# Altium schematic sheet BMS_CPU.SchDoc
size B; Organization: Altium Limited; Address1: L3, 12a Rodborough Rd; Address2: Frenchs Forest; Address3: NSW; Address4: Australia 2086
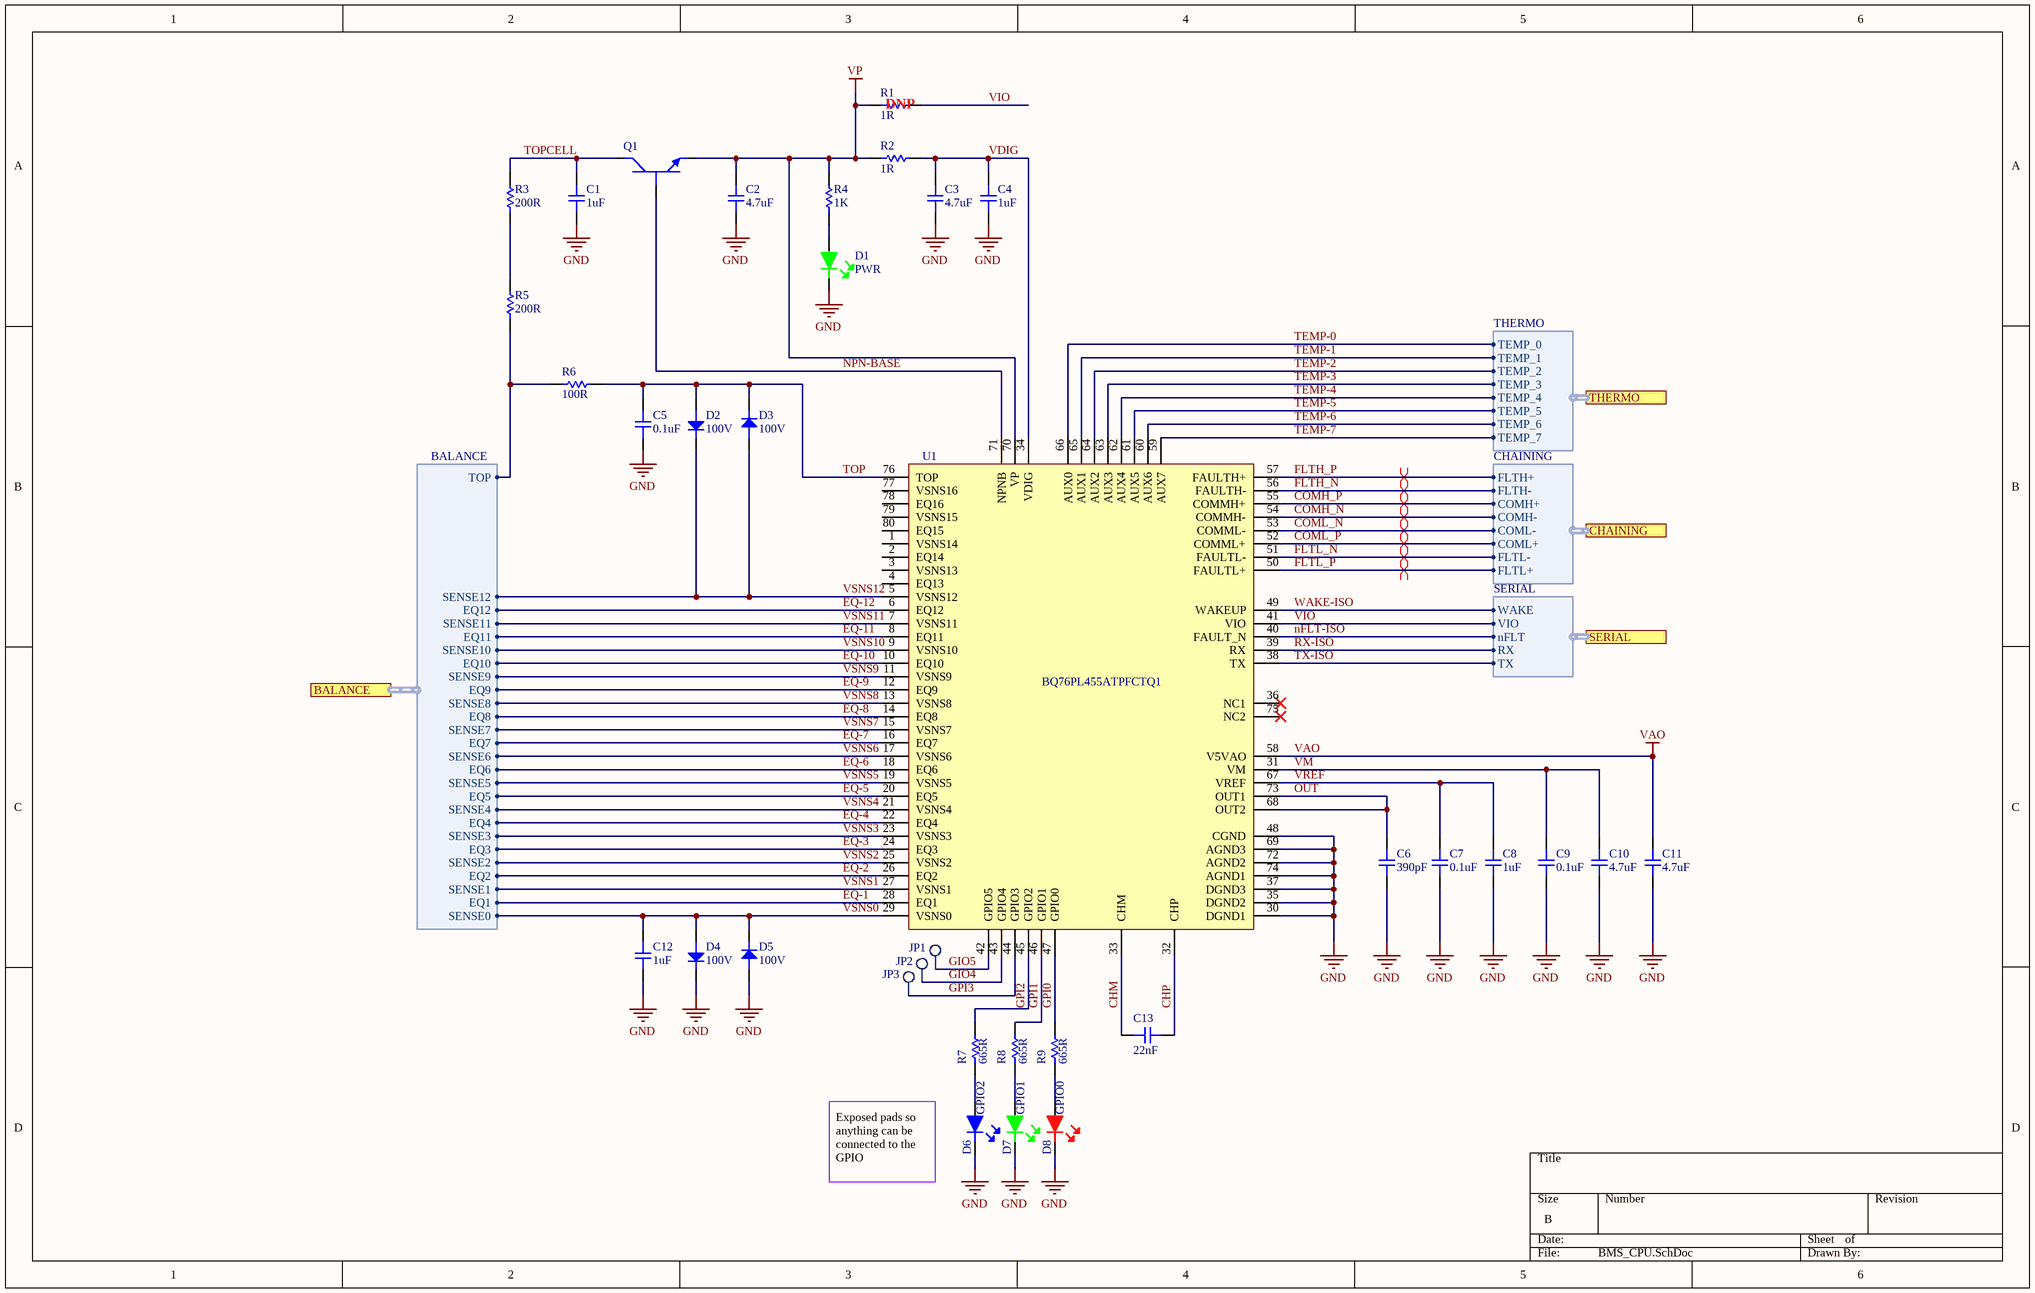
[diagram p0: BMS_CPU.SchDoc]

## Parts
C1  1uF  [CAP-0805]
C2  4.7uF  [CAP-0805]
C3  4.7uF  [CAP-0805]
C4  1uF  [CAP-0805]
C5  0.1uF  [CAP-0805]
C6  390pF  [CAP-0805]
C7  0.1uF  [CAP-0805]
C8  1uF  [CAP-0805]
C9  0.1uF  [CAP-0805]
C10  4.7uF  [CAP-0805]
C11  4.7uF  [CAP-0805]
C12  1uF  [CAP-0805]
C13  22nF  [CAP-0603]
D1  PWR  [LED-0603]
D2  100V  [DIODE-SOD123]
D3  100V  [DIODE-SOD123]
D4  100V  [DIODE-SOD123]
D5  100V  [DIODE-SOD123]
D6  GPIO2  [LED-0603]
D7  GPIO1  [LED-0603]
D8  GPIO0  [LED-0603]
JP1  Testpoint2  [TP2]  (value not drawn)
JP2  Testpoint2  [TP2]  (value not drawn)
JP3  Testpoint2  [TP2]  (value not drawn)
Q1  ZXTN4004KTCDICT-ND  [DPAK-TO252]  (value not drawn)
R1  1R  [RES-0603]
R2  1R  [RES-0603]
R3  200R  [RES-2512]
R4  1K  [RES-0603]
R5  200R  [RES-2512]
R6  100R  [RES-1206]
R7  665R  [RES-0603]
R8  665R  [RES-0603]
R9  665R  [RES-0603]
U1  BQ76PL455ATPFCTQ1  [BQ76PL455A]

## Ports
BALANCE (harness BALANCE), CHAINING (harness CHAINING), SERIAL (harness SERIAL), THERMO (harness THERMO)

## Harnesses
CHAINING: FLTH+, FLTH-, COMH+, COMH-, COML-, COML+, FLTL-, FLTL+
THERMO: TEMP_0, TEMP_1, TEMP_2, TEMP_3, TEMP_4, TEMP_5, TEMP_6, TEMP_7
SERIAL: WAKE, VIO, nFLT, RX, TX
BALANCE: EQ6, SENSE6, EQ7, SENSE7, EQ8, SENSE8, EQ9, SENSE9, SENSE5, EQ5, SENSE4, EQ4, SENSE3, EQ3, SENSE2, EQ2, SENSE1, EQ1, SENSE0, SENSE10, EQ10, TOP, EQ11, SENSE11, SENSE12, EQ12

## Nets
GND: C1.1 C2.1 C3.1 C4.1 C5.2 C6.1 C7.2 C8.1 C9.1 C10.1 C11.1 C12.1 D1.2 D4.1 D5.2 D6.2 D7.2 D8.2 U1.30(DGND1) U1.35(DGND2) U1.37(DGND3) U1.48(CGND) U1.69(AGND3) U1.72(AGND2) U1.74(AGND1)
VAO: C11.2 U1.58(V5VAO)
VP: C2.2 Q1.3 R1.1 R2.1 R4.2 U1.70(VP)
CHM: C13.1 U1.33(CHM)
CHP: C13.2 U1.32(CHP)
COMH_N: U1.54(COMMH-) ; port CHAINING.COMH-
COMH_P: U1.55(COMMH+) ; port CHAINING.COMH+
COML_N: U1.53(COMML-) ; port CHAINING.COML-
COML_P: U1.52(COMML+) ; port CHAINING.COML+
EQ-1: U1.28(EQ1) ; port BALANCE.EQ1
EQ-2: U1.26(EQ2) ; port BALANCE.EQ2
EQ-3: U1.24(EQ3) ; port BALANCE.EQ3
EQ-4: U1.22(EQ4) ; port BALANCE.EQ4
EQ-5: U1.20(EQ5) ; port BALANCE.EQ5
EQ-6: U1.18(EQ6) ; port BALANCE.EQ6
EQ-7: U1.16(EQ7) ; port BALANCE.EQ7
EQ-8: U1.14(EQ8) ; port BALANCE.EQ8
EQ-9: U1.12(EQ9) ; port BALANCE.EQ9
EQ-10: U1.10(EQ10) ; port BALANCE.EQ10
EQ-11: U1.8(EQ11) ; port BALANCE.EQ11
EQ-12: U1.6(EQ12) ; port BALANCE.EQ12
FLTH_N: U1.56(FAULTH-) ; port CHAINING.FLTH-
FLTH_P: U1.57(FAULTH+) ; port CHAINING.FLTH+
FLTL_N: U1.51(FAULTL-) ; port CHAINING.FLTL-
FLTL_P: U1.50(FAULTL+) ; port CHAINING.FLTL+
GIO4: JP2.1 U1.43(GPIO4)
GIO5: JP1.1 U1.42(GPIO5)
GPI0: R9.2 U1.47(GPIO0)
GPI1: R8.2 U1.46(GPIO1)
GPI2: R7.2 U1.45(GPIO2)
GPI3: JP3.1 U1.44(GPIO3)
nFLT-ISO: U1.40(FAULT_N) ; port SERIAL.nFLT
NPN-BASE: Q1.1 U1.71(NPNB)
OUT: C6.2 U1.68(OUT2) U1.73(OUT1)
RX-ISO: U1.39(RX) ; port SERIAL.RX
TEMP-0: U1.66(AUX0) ; port THERMO.TEMP_0
TEMP-1: U1.65(AUX1) ; port THERMO.TEMP_1
TEMP-2: U1.64(AUX2) ; port THERMO.TEMP_2
TEMP-3: U1.63(AUX3) ; port THERMO.TEMP_3
TEMP-4: U1.62(AUX4) ; port THERMO.TEMP_4
TEMP-5: U1.61(AUX5) ; port THERMO.TEMP_5
TEMP-6: U1.60(AUX6) ; port THERMO.TEMP_6
TEMP-7: U1.59(AUX7) ; port THERMO.TEMP_7
TOP: C5.1 D2.2 D3.1 R6.2 U1.76(TOP)
TOPCELL: C1.2 Q1.2 R3.2
TX-ISO: U1.38(TX) ; port SERIAL.TX
VDIG: C3.2 C4.2 R2.2 U1.34(VDIG)
VIO: R1.2 U1.41(VIO) ; port SERIAL.VIO
VM: C9.2 C10.2 U1.31(VM)
VREF: C7.1 C8.2 U1.67(VREF)
VSNS0: C12.2 D4.2 D5.1 U1.29(VSNS0) ; port BALANCE.SENSE0
VSNS1: U1.27(VSNS1) ; port BALANCE.SENSE1
VSNS2: U1.25(VSNS2) ; port BALANCE.SENSE2
VSNS3: U1.23(VSNS3) ; port BALANCE.SENSE3
VSNS4: U1.21(VSNS4) ; port BALANCE.SENSE4
VSNS5: U1.19(VSNS5) ; port BALANCE.SENSE5
VSNS6: U1.17(VSNS6) ; port BALANCE.SENSE6
VSNS7: U1.15(VSNS7) ; port BALANCE.SENSE7
VSNS8: U1.13(VSNS8) ; port BALANCE.SENSE8
VSNS9: U1.11(VSNS9) ; port BALANCE.SENSE9
VSNS10: U1.9(VSNS10) ; port BALANCE.SENSE10
VSNS11: U1.7(VSNS11) ; port BALANCE.SENSE11
VSNS12: D2.1 D3.2 U1.5(VSNS12) ; port BALANCE.SENSE12
WAKE-ISO: U1.49(WAKEUP) ; port SERIAL.WAKE
NetD1_1: D1.1 R4.1
NetD6_1: D6.1 R7.1
NetD7_1: D7.1 R8.1
NetD8_1: D8.1 R9.1
NetR3_1: R3.1 R5.2
NetR5_1: R5.1 R6.1 ; port BALANCE.TOP

Not connected (* = marked no-connect by the designer): U1 1(VSNS14) 2(EQ14) 3(VSNS13) 4(EQ13) 36(NC1)* 75(NC2)* 77(VSNS16) 78(EQ16) 79(VSNS15) 80(EQ15)

## Layout directives
differential pair: COMH_N, COMH_P, COML_N, COML_P, FLTH_N, FLTH_P, FLTL_N, FLTL_P

## Notes on the sheet
- (near R1) DNP
- Exposed pads so anything can be connected to the GPIO
- Title
- Size:
- Date:
- Tabloid
- Number:
- Time:
- Revision:
- Sheet
- of
- File:

## Library data of the parts
C1 C8 C12 = 0805-1uF-50V: CAP CER 1UF 50V X5R 0805; Manufacturer: KEMET; Manufacturer Part Number: C0805C105K5PACTU; Dielectric Material: Ceramic; Tolerance: 10%; Supplier 1: Digi-Key; Stock 1: 7193; Pricing 1: 1=0.33, 10=0.23, 100=0.1378, 500=0.10334, 1000=0.08726 (USD); Mount: Surface Mount; Case/Package: 0805; Weight: 0.000194oz; Case Code (Metric): 2012; Case Code (Imperial): 0805; Min Operating Temperature: -55°C; Max Operating Temperature: 85°C; Voltage Rating: 50V; Dielectric: X5R; Packaging: Tape and Reel; Termination: SMD/SMT; Voltage Rating (DC): 50V; Package Quantity: 2500; Capacitance: 1uF; Length: 0.079inch; Width: 0.049inch; Thickness: 0.055inch; REACH SVHC: No SVHC; Lead Free: Lead Free; ComponentLink1URL: https://api.kemet.com/component-edge/download/datasheet/C0805C105K5PAC7800.pdf?src-supplier=Digi-Key; ComponentLink1Description: https://api.kemet.com/component-edge/download/datasheet/C0805C105K5PAC7800.pdf?src-supplier=Digi-Key; ComponentLink2URL: http://www.farnell.com/datasheets/2746140.pdf?src-supplier=Farnell; ComponentLink2Description: http://www.farnell.com/datasheets/2746140.pdf?src-supplier=Farnell; ComponentLink3URL: http://www.mouser.com/ds/2/212/KEM_C1006_X5R_SMD-1103249.pdf?src-supplier=Mouser; ComponentLink3Description: http://www.mouser.com/ds/2/212/KEM_C1006_X5R_SMD-1103249.pdf?src-supplier=Mouser; ComponentLink4URL: http://www.farnell.com/datasheets/2746140.pdf?src-supplier=Newark; ComponentLink4Description: http://www.farnell.com/datasheets/2746140.pdf?src-supplier=Newark; ComponentLink5URL: http://www.farnell.com/datasheets/2032728.pdf?src-supplier=Element14; ComponentLink5Description: http://www.farnell.com/datasheets/2032728.pdf?src-supplier=Element14; Supplier Part Number 1: 399-15436-6-ND
C2 C3 C10 C11 = 0805-4.7uF-16V: CAP CER 4.7UF 16V X5R 0805; Manufacturer: KEMET; Manufacturer Part Number: C0805C475K4PACTU; Dielectric Material: Ceramic; Tolerance: 10%; Supplier 1: Digi-Key; Stock 1: 96594; Pricing 1: 1=0.24, 10=0.168, 100=0.0951, 500=0.0671, 1000=0.05872 (USD); Mount: Surface Mount; Case/Package: 0805; Min Operating Temperature: -55°C; Max Operating Temperature: 85°C; Capacitance: 4.7uF; Packaging: Tape and Reel; Dielectric: X5R; Voltage: 16V; Termination: SMD/SMT; Voltage Rating (DC): 16V; Length: 2mm; Height: 1.25mm; Depth: 1.25mm; Radiation Hardening: No; Lead Free: Lead Free; ComponentLink1URL: http://capacitoredge.kemet.com/capedge2/DataSheet?pn=C0805C475K4PAC7800&src-supplier=Avnet+Europe; ComponentLink1Description: http://capacitoredge.kemet.com/capedge2/DataSheet?pn=C0805C475K4PAC7800&src-supplier=Avnet+Europe; ComponentLink2URL: https://www.verical.com/server-webapp/html/getDatasheet?partID=319476&src-supplier=Verical; ComponentLink2Description: https://www.verical.com/server-webapp/html/getDatasheet?partID=319476&src-supplier=Verical; Supplier Part Number 1: 399-8101-6-ND
C4 = 0805-1uF-16V: CAP CER 1UF 16V Y5V 0805; Manufacturer: KEMET; Manufacturer Part Number: C0805C105Z4VACTU; Dielectric Material: Ceramic; Tolerance: 80%; Dissipation Factor: 7%; Supplier 1: Digi-Key; Stock 1: 54729; Pricing 1: 1=0.12, 10=0.085, 100=0.0378, 500=0.02702, 1000=0.02124 (USD); Mount: Surface Mount,PCB; Case/Package: 0805; Number of Pins: 2; Case Code (Metric): 2012; Case Code (Imperial): 0805; Contact Material: Tin; Min Operating Temperature: -30°C; Max Operating Temperature: 85°C; Package Quantity: 1; Capacitance: 1uF; Voltage Rating: 16V; Packaging: Tape and Reel; Voltage Rating (DC): 16V; Dielectric: Y5V; Termination: SMD/SMT; Voltage: 16V; Length: 2mm; Height: 1.25mm; Width: 0.049inch; Thickness: 0.055inch; Lead Pitch: 0.75mm; Depth: 1.25mm; Radiation Hardening: No; REACH SVHC: No SVHC; Lead Free: Lead Free; ComponentLink1URL: http://www.farnell.com/datasheets/2739656.pdf?src-supplier=Farnell; ComponentLink1Description: http://www.farnell.com/datasheets/2739656.pdf?src-supplier=Farnell; ComponentLink2URL: http://capacitoredge.kemet.com/capedge2/DataSheet?pn=C0805C105Z4VAC7800&src-supplier=Avnet+Europe; ComponentLink2Description: http://capacitoredge.kemet.com/capedge2/DataSheet?pn=C0805C105Z4VAC7800&src-supplier=Avnet+Europe; ComponentLink3URL: https://www.alliedelec.com/m/d/9bfe7773041ffe9d406e68bc7b377fdd.pdf?src-supplier=Allied+Electronics; ComponentLink3Description: https://www.alliedelec.com/m/d/9bfe7773041ffe9d406e68bc7b377fdd.pdf?src-supplier=Allied+Electronics; ComponentLink4URL: http://www.farnell.com/datasheets/2739656.pdf?src-supplier=Newark; ComponentLink4Description: http://www.farnell.com/datasheets/2739656.pdf?src-supplier=Newark; Supplier Part Number 1: 399-8011-6-ND
C5 C7 C9 = 0805-0.1uF-50V: CAP CER 0.1UF 50V Y5V 0805; Manufacturer: KEMET; Manufacturer Part Number: C0805C104Z5VACTU; Dielectric Material: Ceramic; Capacitance: 100nF; Tolerance: 80%; Dissipation Factor: 5%; Supplier 1: Digi-Key; Stock 1: 929243; Pricing 1: 1=0.1, 10=0.057, 100=0.0254, 500=0.01818, 1000=0.01428 (USD); Mount: Surface Mount,PCB; Case/Package: 0805; Number of Pins: 2; Case Code (Metric): 2012; Case Code (Imperial): 0805; Min Operating Temperature: -30°C; Max Operating Temperature: 85°C; Package Quantity: 1; Voltage Rating: 50V; Packaging: Tape and Reel; Voltage Rating (DC): 50V; Dielectric: Y5V; Termination: SMD/SMT; Voltage: 50V; Length: 2mm; Height: 0.9mm; Lead Pitch: 0.75mm; Width: 0.049inch; Thickness: 0.039inch; Depth: 1.25mm; Radiation Hardening: No; REACH SVHC: No SVHC; Lead Free: Lead Free; ComponentLink1URL: http://www.alliedelec.com/m/d/9bfe7773041ffe9d406e68bc7b377fdd.pdf?src-supplier=Allied+Electronics; ComponentLink1Description: http://www.alliedelec.com/m/d/9bfe7773041ffe9d406e68bc7b377fdd.pdf?src-supplier=Allied+Electronics; ComponentLink2URL: https://www.verical.com/server-webapp/html/getDatasheet?partID=37101&src-supplier=Verical; ComponentLink2Description: https://www.verical.com/server-webapp/html/getDatasheet?partID=37101&src-supplier=Verical; ComponentLink3URL: https://www.verical.com/server-webapp/html/getDatasheet?partID=321176&src-supplier=Verical; ComponentLink3Description: https://www.verical.com/server-webapp/html/getDatasheet?partID=321176&src-supplier=Verical; ComponentLink4URL: http://www.farnell.com/datasheets/2123124.pdf?src-supplier=Element14; ComponentLink4Description: http://www.farnell.com/datasheets/2123124.pdf?src-supplier=Element14; Supplier Part Number 1: 399-1177-6-ND
C6 = 0805-390pF-50V: CAP CER 390PF 50V C0G/NP0 0805; Manufacturer: KEMET; Manufacturer Part Number: C0805C391J5GACTU; Dielectric Material: Ceramic; Tolerance: 5%; Dissipation Factor: 0.1%; Dielectric: C0G; Supplier 1: Digi-Key; Stock 1: 12778; Pricing 1: 1=0.15, 10=0.105, 100=0.0495, 500=0.03472, 1000=0.02875 (USD); Mount: Surface Mount,PCB; Case/Package: 0805; Case Code (Metric): 2012; Case Code (Imperial): 0805; Contact Material: Tin; Contact Plating: Tin,Matte; Min Operating Temperature: -55°C; Max Operating Temperature: 125°C; Package Quantity: 1; Capacitance: 390pF; Voltage Rating: 50V; Packaging: Tape and Reel; Termination: SMD/SMT; Voltage Rating (DC): 50V; Voltage: 50V; Length: 2mm; Height: 0.78mm; Width: 0.049inch; Lead Pitch: 0.75mm; Depth: 1.25mm; Thickness: 0.035inch; Radiation Hardening: No; REACH SVHC: No SVHC; Lead Free: Lead Free; ComponentLink1URL: https://search.kemet.com/component-edge/download/datasheet/C0805C391J5GACTU.pdf?src-supplier=Digi-Key; ComponentLink1Description: https://search.kemet.com/component-edge/download/datasheet/C0805C391J5GACTU.pdf?src-supplier=Digi-Key; ComponentLink2URL: https://www.verical.com/server-webapp/html/getDatasheet?partID=35246&src-supplier=Verical; ComponentLink2Description: https://www.verical.com/server-webapp/html/getDatasheet?partID=35246&src-supplier=Verical; ComponentLink3URL: https://www.alliedelec.com/m/d/9bfe7773041ffe9d406e68bc7b377fdd.pdf?src-supplier=Allied+Electronics; ComponentLink3Description: https://www.alliedelec.com/m/d/9bfe7773041ffe9d406e68bc7b377fdd.pdf?src-supplier=Allied+Electronics; ComponentLink4URL: http://www.farnell.com/datasheets/1372242.pdf?src-supplier=Element14; ComponentLink4Description: http://www.farnell.com/datasheets/1372242.pdf?src-supplier=Element14; ComponentLink5URL: http://www.jameco.com/Jameco/Products/ProdDS/1567367.pdf?src-supplier=Jameco; ComponentLink5Description: http://www.jameco.com/Jameco/Products/ProdDS/1567367.pdf?src-supplier=Jameco; Supplier Part Number 1: 399-1132-6-ND
C13 = 0603-22nF-100V: CAP CER 0.022UF 100V X7R 0603; Manufacturer: KEMET; Manufacturer Part Number: C0603C223K1RACTU; Dielectric Material: Ceramic; Tolerance: 10%; Dissipation Factor: 2.5%; Supplier 1: Digi-Key; Stock 1: 681721; Pricing 1: 1=0.1, 10=0.042, 100=0.0186, 500=0.01328, 1000=0.01044 (USD); Mount: Surface Mount,PCB; Case/Package: 0603; Number of Pins: 2; Case Code (Metric): 1608; Case Code (Imperial): 0603; Min Operating Temperature: -55°C; Max Operating Temperature: 125°C; Package Quantity: 4000; Capacitance: 22nF; Voltage Rating: 100V; Packaging: Tape and Reel; Voltage Rating (DC): 100V; Dielectric: X7R; Termination: SMD/SMT; Voltage: 100V; Length: 1.6mm; Height: 0.8mm; Width: 0.031inch; Thickness: 0.034inch; Depth: 0.8mm; Lead Pitch: 0.7mm; Radiation Hardening: No; REACH SVHC: No SVHC; ComponentLink1URL: http://www.mouser.com/ds/2/212/KEM_C1002_X7R_SMD-1102033.pdf?src-supplier=Mouser; ComponentLink1Description: http://www.mouser.com/ds/2/212/KEM_C1002_X7R_SMD-1102033.pdf?src-supplier=Mouser; ComponentLink2URL: https://www.verical.com/server-webapp/html/getDatasheet?partID=306025&src-supplier=Verical; ComponentLink2Description: https://www.verical.com/server-webapp/html/getDatasheet?partID=306025&src-supplier=Verical; ComponentLink3URL: https://www.verical.com/server-webapp/html/getDatasheet?partID=38414&src-supplier=Verical; ComponentLink3Description: https://www.verical.com/server-webapp/html/getDatasheet?partID=38414&src-supplier=Verical; Supplier Part Number 1: 399-3476-6-ND
D1 D7 = LED-Green: LED GREEN CLEAR 0603 SMD; Manufacturer: Wurth Electronics; Manufacturer Part Number: 150060VS75000; Luminous Intensity: 40mcd; Viewing Angle: 140°; Forward Voltage: 2V; Wavelength: 570nm; Lens Style: Clear,Rectangular; Forward Current: 30mA; Test Current: 20mA; Supplier 1: Digi-Key; Stock 1: 118118; Pricing 1: 1=0.14, 50=0.133, 100=0.114, 500=0.099 (USD); Mount: Surface Mount; Case/Package: 0603; Number of Pins: 2; Color: Green; Case Code (Metric): 1608; Case Code (Imperial): 0603; Min Operating Temperature: -40°C; Max Operating Temperature: 85°C; Package Quantity: 1; Packaging: Tape and Reel; Dominant Wavelength: 570nm; Length: 1.6mm; Height: 0.7mm; Width: 0.8mm; REACH SVHC: Unknown; ComponentLink1URL: https://katalog.we-online.de/led/datasheet/150060VS75000.pdf?src-supplier=Digi-Key; ComponentLink1Description: https://katalog.we-online.de/led/datasheet/150060VS75000.pdf?src-supplier=Digi-Key; Supplier Part Number 1: 732-4980-1-ND
D2-D5 = Diode-100V-0.3W: DIODE GEN PURP 100V 300MA SOD123; Manufacturer: Diodes; Manufacturer Part Number: 1N4148W-7-F; Max Surge Current: 2A; Forward Current: 150mA; Peak Reverse Current: 1uA; Recovery Time: 4ns; Forward Voltage: 1.25V; Power Dissipation: 400mW; Element Configuration: Single; Polarity: Standard; Voltage Rating (DC): 75V; Capacitance: 2pF; Supplier 1: Digi-Key; Stock 1: 3713964; Pricing 1: 1=0.16, 10=0.146, 25=0.1388, 100=0.0611, 250=0.05868, 500=0.048, 1000=0.03333 (USD); Mount: Surface Mount; Number of Pins: 2; Weight: 0.000353oz; Contact Plating: Tin,Matte; Min Operating Temperature: -65°C; Max Operating Temperature: 150°C; Package Quantity: 3000; Packaging: Tape and Reel; Average Rectified Current: 300mA; Reverse Recovery Time: 4ns; Max Repetitive Reverse Voltage (Vrrm): 100V; Max Forward Surge Current (Ifsm): 2A; Peak Non-Repetitive Surge Current: 2A; Power Rating: 400mW; Current Rating: 150mA; Output Current: 150mA; Voltage: 100V; Max Reverse Voltage (DC): 100V; Length: 2.85mm; Height: 1.25mm; Width: 1.7mm; Radiation Hardening: No; REACH SVHC: No SVHC; Lead Free: Lead Free; ComponentLink1URL: https://www.diodes.com/assets/Datasheets/ds30086.pdf?src-supplier=Digi-Key; ComponentLink1Description: https://www.diodes.com/assets/Datasheets/ds30086.pdf?src-supplier=Digi-Key; ComponentLink2URL: http://www.farnell.com/datasheets/1915529.pdf?src-supplier=Element14; ComponentLink2Description: http://www.farnell.com/datasheets/1915529.pdf?src-supplier=Element14; ComponentLink3URL: http://www.mouser.com/ds/2/115/ds30086-60872.pdf?src-supplier=Mouser; ComponentLink3Description: http://www.mouser.com/ds/2/115/ds30086-60872.pdf?src-supplier=Mouser; ComponentLink4URL: https://www.diodes.com/assets/Datasheets/ds30086.pdf?src-supplier=Avnet; ComponentLink4Description: https://www.diodes.com/assets/Datasheets/ds30086.pdf?src-supplier=Avnet; ComponentLink5URL: https://www.diodes.com/assets/Datasheets/ds30086.pdf?src-supplier=Avnet+Europe; ComponentLink5Description: https://www.diodes.com/assets/Datasheets/ds30086.pdf?src-supplier=Avnet+Europe; ComponentLink6URL: https://www.diodes.com/assets/Datasheets/ds30086.pdf?src-supplier=Verical; ComponentLink6Description: https://www.diodes.com/assets/Datasheets/ds30086.pdf?src-supplier=Verical; Supplier Part Number 1: 1N4148W-FDIDKR-ND
D6 = LED-Blue: LED BLUE CLEAR 0603 SMD; Manufacturer: Wurth Electronics; Manufacturer Part Number: 150060BS75000; Luminous Intensity: 145mcd; Forward Current: 30mA; Forward Voltage: 3.2V; Wavelength: 470nm; Viewing Angle: 140°; Lens Style: Clear,Rectangular; Test Current: 20mA; Supplier 1: Digi-Key; Stock 1: 46078; Pricing 1: 1=0.16, 50=0.145, 100=0.125, 500=0.108 (USD); Mount: Surface Mount; Case/Package: 0603; Color: Blue; Case Code (Metric): 1608; Case Code (Imperial): 0603; Min Operating Temperature: -40°C; Max Operating Temperature: 85°C; Package Quantity: 4000; Packaging: Cut Tape; Dominant Wavelength: 470nm; Length: 1.6mm; Height: 0.7mm; Width: 0.8mm; REACH SVHC: Unknown; ComponentLink1URL: https://www.distrelec.biz/Web/Downloads/_t/ds/150060BS75000_eng_tds.pdf?mime=application%2Fpdf&src-supplier=Distrelec; ComponentLink1Description: https://www.distrelec.biz/Web/Downloads/_t/ds/150060BS75000_eng_tds.pdf?mime=application%2Fpdf&src-supplier=Distrelec; ComponentLink2URL: https://katalog.we-online.de/led/datasheet/150060BS75000.pdf?src-supplier=Digi-Key; ComponentLink2Description: https://katalog.we-online.de/led/datasheet/150060BS75000.pdf?src-supplier=Digi-Key; ComponentLink3URL: http://www.farnell.com/datasheets/1911343.pdf?src-supplier=Element14; ComponentLink3Description: http://www.farnell.com/datasheets/1911343.pdf?src-supplier=Element14; ComponentLink4URL: http://www.produktinfo.conrad.com/datenblaetter/750000-774999/759426-da-01-en-CHIPLED_0603_W_KL_BLAU_150060BS75000.pdf?src-supplier=Conrad; ComponentLink4Description: http://www.produktinfo.conrad.com/datenblaetter/750000-774999/759426-da-01-en-CHIPLED_0603_W_KL_BLAU_150060BS75000.pdf?src-supplier=Conrad; Supplier Part Number 1: 732-4966-6-ND
D8 = LED-Red: LED RED CLEAR 0603 SMD; Manufacturer: Wurth Electronics; Manufacturer Part Number: 150060RS75000; Viewing Angle: 140°; Lens Style: Clear,Rectangular; Luminous Intensity: 250mcd; Forward Current: 30mA; Forward Voltage: 2V; Wavelength: 625nm; Test Current: 20mA; Supplier 1: Digi-Key; Stock 1: 18518; Pricing 1: 1=0.14, 50=0.133, 100=0.114, 500=0.099 (USD); Mount: Surface Mount; Case/Package: 0603; Color: Red; Case Code (Metric): 1608; Case Code (Imperial): 0603; Min Operating Temperature: -40°C; Max Operating Temperature: 85°C; Package Quantity: 1; Packaging: Cut Tape; Dominant Wavelength: 625nm; Length: 1.6mm; Height: 0.7mm; Width: 0.8mm; REACH SVHC: Unknown; ComponentLink1URL: https://katalog.we-online.de/led/datasheet/150060RS75000.pdf?src-supplier=Digi-Key; ComponentLink1Description: https://katalog.we-online.de/led/datasheet/150060RS75000.pdf?src-supplier=Digi-Key; ComponentLink2URL: http://www.produktinfo.conrad.com/datenblaetter/750000-774999/759428-da-01-en-CHIPLED_0603_W_KL_ROT_150060RS75000.pdf?src-supplier=Conrad; ComponentLink2Description: http://www.produktinfo.conrad.com/datenblaetter/750000-774999/759428-da-01-en-CHIPLED_0603_W_KL_ROT_150060RS75000.pdf?src-supplier=Conrad; Supplier Part Number 1: 732-4978-6-ND
JP1-JP3 = Testpoint2: Single layer pad TP
Q1 = NPN-150V-1A: TRANS NPN 150V 1A TO252; Manufacturer: Diodes; Max Power Dissipation: 3.8W; Number of Elements: 1; hFE Min: 100; Emitter Base Voltage (VEBO): 7V; Element Configuration: Single; Supplier 1: Digi-Key; Manufacturer Part Number: ZXTN4004KTC; Stock 1: 16465; Pricing 1: 1=0.44, 10=0.374, 25=0.3492, 100=0.2595, 250=0.24648, 500=0.20258, 1000=0.16465 (USD); Mount: Surface Mount; Case/Package: TO-252; Number of Pins: 3; Weight: 0.063493oz; Min Operating Temperature: -55°C; Max Operating Temperature: 150°C; Packaging: Tape and Reel; Package Quantity: 2500; Polarity: NPN; Collector Emitter Voltage (VCEO): 150V; Collector Base Voltage (VCBO): 150V; Continuous Collector Current: 1A; Max Collector Current: 1A; Collector Emitter Breakdown Voltage: 150V; Max Breakdown Voltage: 150V; Power Dissipation: 3.8W; Length: 6.7mm; Height: 6.2mm; Width: 2.39mm; Radiation Hardening: No; Lead Free: Lead Free; REACH SVHC: No SVHC; ComponentLink1URL: http://www.mouser.com/ds/2/115/ZXTN4004K-219140.pdf?src-supplier=Mouser; ComponentLink1Description: http://www.mouser.com/ds/2/115/ZXTN4004K-219140.pdf?src-supplier=Mouser; ComponentLink2URL: http://www.diodes.com/datasheets/ZXTN4004K.pdf?src-supplier=Avnet; ComponentLink2Description: http://www.diodes.com/datasheets/ZXTN4004K.pdf?src-supplier=Avnet; ComponentLink3URL: http://www.diodes.com/datasheets/ZXTN4004K.pdf?src-supplier=Avnet+Europe; ComponentLink3Description: http://www.diodes.com/datasheets/ZXTN4004K.pdf?src-supplier=Avnet+Europe; ComponentLink4URL: https://www.diodes.com/assets/Datasheets/ZXTN4004K.pdf?src-supplier=Digi-Key; ComponentLink4Description: https://www.diodes.com/assets/Datasheets/ZXTN4004K.pdf?src-supplier=Digi-Key; Supplier Part Number 1: ZXTN4004KTCDIDKR-ND
R1 R2 = 0603-1R: RES SMD 1 OHM 1% 1/10W 0603; Manufacturer: Yageo; Manufacturer Part Number: RC0603FR-071RL; Voltage Rating (DC): 50V; Temperature Coefficient: 200ppm/°C; Power Rating: 100mW; Supplier 1: Digi-Key; Stock 1: 9330143; Pricing 1: 1=0.1, 10=0.046, 100=0.0187, 1000=0.0084, 2500=0.00729 (USD); Case/Package: 0603; Number of Pins: 2; Case Code (Imperial): 0603; Case Code (Metric): 1608; Min Operating Temperature: -55°C; Max Operating Temperature: 155°C; Resistance: 1R; Tolerance: 1%; Packaging: Tape and Reel; Composition: Thick Film; Voltage Rating: 50V; Termination: SMD/SMT; Package Quantity: 1; Number of Terminations: 2; Max Power Dissipation: 100mW; Features: Moisture Resistant; Length: 0.063inch; Height: 0.022inch; Width: 0.031inch; Depth: 0.8mm; REACH SVHC: Unknown; Lead Free: Lead Free; ComponentLink1URL: http://www.yageo.com/documents/recent/PYu-RC_Group_51_RoHS_L_10.pdf?src-supplier=Digi-Key; ComponentLink1Description: http://www.yageo.com/documents/recent/PYu-RC_Group_51_RoHS_L_10.pdf?src-supplier=Digi-Key; ComponentLink2URL: http://www.farnell.com/datasheets/2167052.pdf?src-supplier=Element14; ComponentLink2Description: http://www.farnell.com/datasheets/2167052.pdf?src-supplier=Element14; ComponentLink3URL: http://www.farnell.com/datasheets/1868787.pdf?src-supplier=Element14; ComponentLink3Description: http://www.farnell.com/datasheets/1868787.pdf?src-supplier=Element14; Supplier Part Number 1: 311-1.00HRDKR-ND
R3 R5 = 2512-200R: RES SMD 200 OHM 1% 1W 2512; Manufacturer: Vishay; Manufacturer Part Number: CRCW2512200RFKEG; Temperature Coefficient: 100ppm/°C; Voltage Rating: 500V; Supplier 1: Digi-Key; Stock 1: 27582; Pricing 1: 1=0.38, 10=0.318, 100=0.1242, 1000=0.05198 (USD); Case/Package: 2512; Number of Pins: 2; Weight: 0.001429oz; Contact Plating: Tin; Case Code (Imperial): 2512; Case Code (Metric): 6432; Min Operating Temperature: -55°C; Max Operating Temperature: 155°C; Resistance: 200R; Power Rating: 1W; Tolerance: 1%; Packaging: Tape and Reel; Composition: Thick Film; Number of Terminations: 2; Military Standard: Not; Max Power Dissipation: 1W; Package Quantity: 10; Voltage Rating (DC): 500V; Termination: SMD/SMT; Features: Automotive AEC-Q200; Length: 6.3mm; Height: 0.028inch; Width: 3.15mm; Depth: 3.15mm; Radiation Hardening: No; Lead Free: Lead Free; REACH SVHC: Unknown; ComponentLink1URL: https://www.alliedelec.com/m/d/0c934d6939ccefa68dbe0b96d821c8cf.pdf?src-supplier=Allied+Electronics; ComponentLink1Description: https://www.alliedelec.com/m/d/0c934d6939ccefa68dbe0b96d821c8cf.pdf?src-supplier=Allied+Electronics; ComponentLink2URL: http://www.vishay.com/docs/20035/dcrcwe3.pdf?src-supplier=Digi-Key; ComponentLink2Description: http://www.vishay.com/docs/20035/dcrcwe3.pdf?src-supplier=Digi-Key; ComponentLink3URL: http://www.vishay.com/docs/20035/dcrcwe3.pdf?src-supplier=Avnet; ComponentLink3Description: http://www.vishay.com/docs/20035/dcrcwe3.pdf?src-supplier=Avnet; ComponentLink4URL: http://www.vishay.com/docs/20035/dcrcwe3.pdf?src-supplier=Future+Electronics; ComponentLink4Description: http://www.vishay.com/docs/20035/dcrcwe3.pdf?src-supplier=Future+Electronics; Supplier Part Number 1: 541-200AFDKR-ND
R4 = 0603-1KR: RES SMD 1K OHM 1% 1/10W 0603; Manufacturer: Vishay Dale; Manufacturer Part Number: CRCW06031K00FKEA; Resistance: 1kR; Power Rating: 100mW; Voltage Rating: 75V; Temperature Coefficient: 100ppm/°C; Supplier 1: Digi-Key; Stock 1: 671453; Pricing 1: 1=0.1, 10=0.034, 100=0.0139, 1000=0.00623, 2500=0.0054 (USD); Mount: Surface Mount; Case/Package: 0603; Number of Pins: 2; Weight: 7.1E-05oz; Case Code (Metric): 1608; Case Code (Imperial): 0603; Contact Plating: Tin; Min Operating Temperature: -55°C; Max Operating Temperature: 155°C; Composition: Thick Film; Tolerance: 1%; Packaging: Tape and Reel; Package Quantity: 10; Number of Terminations: 2; Termination: SMD/SMT; Military Standard: Not; Max Power Dissipation: 100mW; Voltage Rating (DC): 75V; Features: Automotive AEC-Q200; Length: 1.55mm; Height: 0.45mm; Width: 0.033inch; Depth: 0.85mm; Radiation Hardening: No; REACH SVHC: Unknown; Lead Free: Lead Free; ComponentLink1URL: http://www.vishay.com/docs/20035/dcrcwe3.pdf?src-supplier=Digi-Key; ComponentLink1Description: http://www.vishay.com/docs/20035/dcrcwe3.pdf?src-supplier=Digi-Key; ComponentLink2URL: http://uk.rs-online.com/webdocs/0d98/0900766b80d98afc.pdf?src-supplier=RSComponents; ComponentLink2Description: http://uk.rs-online.com/webdocs/0d98/0900766b80d98afc.pdf?src-supplier=RSComponents; ComponentLink3URL: http://www.vishay.com/docs/20035/dcrcwe3.pdf?src-supplier=Avnet; ComponentLink3Description: http://www.vishay.com/docs/20035/dcrcwe3.pdf?src-supplier=Avnet; ComponentLink4URL: http://www.vishay.com/docs/20035/dcrcwe3.pdf?src-supplier=Avnet+Asia; ComponentLink4Description: http://www.vishay.com/docs/20035/dcrcwe3.pdf?src-supplier=Avnet+Asia; ComponentLink5URL: http://www.farnell.com/datasheets/2310790.pdf?src-supplier=Element14; ComponentLink5Description: http://www.farnell.com/datasheets/2310790.pdf?src-supplier=Element14; ComponentLink6URL: https://www.distrelec.biz/Web/Downloads/a_/en/flD-CRCW-e3_data_en.pdf?mime=application%2Fpdf&src-supplier=Distrelec; ComponentLink6Description: https://www.distrelec.biz/Web/Downloads/a_/en/flD-CRCW-e3_data_en.pdf?mime=application%2Fpdf&src-supplier=Distrelec; ComponentLink7URL: http://www.vishay.com/docs/20035/dcrcwe3.pdf?src-supplier=Future+Electronics; ComponentLink7Description: http://www.vishay.com/docs/20035/dcrcwe3.pdf?src-supplier=Future+Electronics; ComponentLink8URL: http://www.vishay.com/docs/20035/dcrcwe3.pdf?src-supplier=Avnet+Europe; ComponentLink8Description: http://www.vishay.com/docs/20035/dcrcwe3.pdf?src-supplier=Avnet+Europe; Supplier Part Number 1: 541-1.00KHCT-ND
R6 = 1206-100R: RES SMD 100 OHM 1% 1/4W 1206; Manufacturer: Yageo; Manufacturer Part Number: RC1206FR-07100RL; Power Rating: 250mW; Voltage Rating: 200V; Temperature Coefficient: 100ppm/°C; Supplier 1: Digi-Key; Stock 1: 4010302; Pricing 1: 1=0.1, 10=0.071, 100=0.0291, 1000=0.01306, 2500=0.01134 (USD); Case/Package: 1206; Case Code (Imperial): 1206; Case Code (Metric): 3216; Min Operating Temperature: -55°C; Max Operating Temperature: 155°C; Tolerance: 1%; Packaging: Tape and Reel; Resistance: 100R; Package Quantity: 5000; Termination: SMD/SMT; Composition: Thick Film; Length: 3.1mm; Height: 0.55mm; Width: 1.6mm; Depth: 1.6mm; REACH SVHC: Unknown; Lead Free: Lead Free; ComponentLink1URL: http://www.farnell.com/datasheets/2167052.pdf?src-supplier=Element14; ComponentLink1Description: http://www.farnell.com/datasheets/2167052.pdf?src-supplier=Element14; ComponentLink2URL: http://documents.rs-components.com/techlib://itc_doclist_GB.htm?stockno=6182271&src-supplier=RSComponents; ComponentLink2Description: http://documents.rs-components.com/techlib://itc_doclist_GB.htm?stockno=6182271&src-supplier=RSComponents; Supplier Part Number 1: 311-100FRDKR-ND
R7-R9 = 0603-665R: RES SMD 665 OHM 1% 1/10W 0603; Manufacturer: Yageo; Manufacturer Part Number: RC0603FR-07665RL; Power Rating: 100mW; Voltage Rating: 75V; Temperature Coefficient: 100ppm/°C; Voltage Rating (DC): 50V; Supplier 1: Digi-Key; Stock 1: 143871; Pricing 1: 1=0.1, 10=0.023, 100=0.0094, 1000=0.00421, 2500=0.00366 (USD); Case/Package: 0603; Weight: 7.1E-05oz; Case Code (Imperial): 0603; Case Code (Metric): 1608; Contact Plating: Tin,Matte; Min Operating Temperature: -55°C; Max Operating Temperature: 155°C; Resistance: 665R; Tolerance: 1%; Packaging: Tape and Reel; Termination: SMD/SMT; Composition: Thick Film; Military Standard: Not; Package Quantity: 1; Number of Terminations: 2; Max Power Dissipation: 100mW; Features: Moisture Resistant; Length: 1.6mm; Height: 0.022inch; Width: 0.8mm; Depth: 0.8mm; Lead Free: Lead Free; ComponentLink1URL: http://www.yageo.com/documents/recent/PYu-RC_Group_51_RoHS_L_9.pdf?src-supplier=Digi-Key; ComponentLink1Description: http://www.yageo.com/documents/recent/PYu-RC_Group_51_RoHS_L_9.pdf?src-supplier=Digi-Key; ComponentLink2URL: http://www.yageo.com/documents/recent/PYu-RC0603_51_RoHS_L_4.pdf?src-supplier=Avnet; ComponentLink2Description: http://www.yageo.com/documents/recent/PYu-RC0603_51_RoHS_L_4.pdf?src-supplier=Avnet; ComponentLink3URL: http://www.yageo.com/documents/recent/PYu-RC_Group_51_RoHS_L_10.pdf?src-supplier=Digi-Key; ComponentLink3Description: http://www.yageo.com/documents/recent/PYu-RC_Group_51_RoHS_L_10.pdf?src-supplier=Digi-Key; ComponentLink4URL: http://www.yageo.com/documents/recent/PYu-RC0603_51_RoHS_L_4.pdf?src-supplier=Avnet+Europe; ComponentLink4Description: http://www.yageo.com/documents/recent/PYu-RC0603_51_RoHS_L_4.pdf?src-supplier=Avnet+Europe; Supplier Part Number 1: 311-665HRDKR-ND
U1 = BQ76PL455ATPFCTQ1: IC BATT MONITOR/PROTECT 80TQFP; Manufacturer: Texas Instruments; Supplier 1: Digi-Key; Manufacturer Part Number: BQ76PL455ATPFCTQ1; Stock 1: 226; Pricing 1: 1=20.82, 10=19.132, 25=18.3392, 100=15.3652 (USD); Mount: Surface Mount; Case/Package: TQFP; Contact Plating: Gold; Min Operating Temperature: -40°C; Max Operating Temperature: 105°C; Lead Free: Lead Free; ComponentLink1URL: http://www.ti.com/lit/pdf/sluub67?src-supplier=Digi-Key; ComponentLink1Description: http://www.ti.com/lit/pdf/sluub67?src-supplier=Digi-Key; ComponentLink2URL: http://www.ti.com/lit/gpn/bq76pl455a-q1?src-supplier=Mouser; ComponentLink2Description: http://www.ti.com/lit/gpn/bq76pl455a-q1?src-supplier=Mouser; ComponentLink3URL: http://www.ti.com/general/docs/lit/getliterature.tsp?genericPartNumber=BQ76PL455A-Q1&&fileType=pdf&src-supplier=Avnet; ComponentLink3Description: http://www.ti.com/general/docs/lit/getliterature.tsp?genericPartNumber=BQ76PL455A-Q1&&fileType=pdf&src-supplier=Avnet; ComponentLink4URL: http://www.ti.com/general/docs/suppproductinfo.tsp?distId=10&amp;gotoUrl=http%3A%2F%2Fwww.ti.com%2Flit%2Fgpn%2Fbq76pl455a-q1&src-supplier=Digi-Key; ComponentLink4Description: http://www.ti.com/general/docs/suppproductinfo.tsp?distId=10&amp;gotoUrl=http%3A%2F%2Fwww.ti.com%2Flit%2Fgpn%2Fbq76pl455a-q1&src-supplier=Digi-Key; Supplier Part Number 1: 296-48288-6-ND